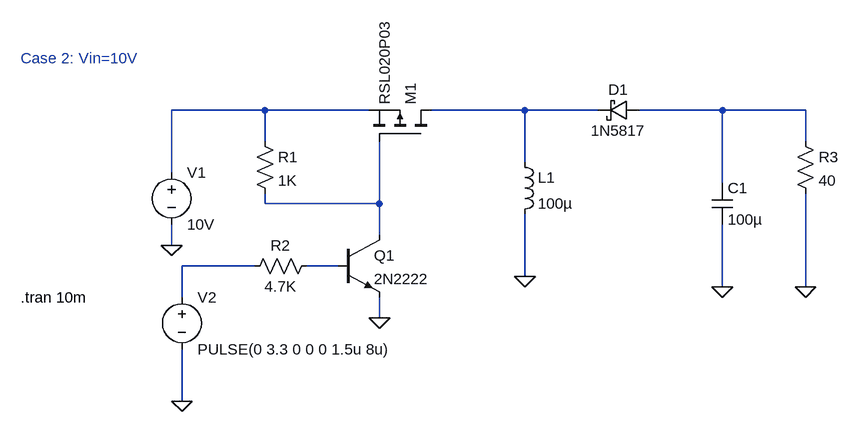
[diagram p0: schematic Buck-Boost Converter LTspice.asc]
Buck-Boost Converter LTspice.asc, the LTspice schematic file:
Version 4.1
SHEET 1 1056 680
WIRE -16 96 -160 96
WIRE 144 96 -16 96
WIRE 384 96 240 96
WIRE 496 96 384 96
WIRE 688 96 560 96
WIRE 816 96 688 96
WIRE -16 144 -16 96
WIRE 816 144 816 96
WIRE 384 176 384 96
WIRE -160 192 -160 96
WIRE 688 208 688 96
WIRE -16 240 -16 224
WIRE 160 240 160 144
WIRE 160 240 -16 240
WIRE 160 288 160 240
WIRE -160 304 -160 272
WIRE -32 336 -144 336
WIRE 96 336 48 336
WIRE 384 352 384 256
WIRE 688 368 688 272
WIRE 816 368 816 224
WIRE -144 384 -144 336
WIRE 160 416 160 384
WIRE -144 544 -144 464
FLAG -160 304 0
FLAG -144 544 0
FLAG 160 416 0
FLAG 384 352 0
FLAG 688 368 0
FLAG 816 368 0
SYMBOL pmos 240 144 M270
SYMATTR InstName M1
SYMATTR Value RSL020P03
SYMBOL npn 96 288 R0
SYMATTR InstName Q1
SYMATTR Value 2N2222
SYMBOL voltage -160 176 R0
WINDOW 123 0 0 Left 0
WINDOW 39 0 0 Left 0
SYMATTR InstName V1
SYMATTR Value 10V
SYMBOL res -32 128 R0
SYMATTR InstName R1
SYMATTR Value 1K
SYMBOL voltage -144 368 R0
WINDOW 123 0 0 Left 0
WINDOW 39 0 0 Left 0
SYMATTR InstName V2
SYMATTR Value PULSE(0 3.3 0 0 0 1.5u 8u)
SYMBOL res 64 320 R90
WINDOW 0 0 56 VBottom 2
WINDOW 3 32 56 VTop 2
SYMATTR InstName R2
SYMATTR Value 4.7K
SYMBOL ind 368 160 R0
SYMATTR InstName L1
SYMATTR Value 100µ
SYMATTR SpiceLine Rser=1m
SYMBOL schottky 560 80 R90
WINDOW 0 0 32 VBottom 2
WINDOW 3 32 32 VTop 2
SYMATTR InstName D1
SYMATTR Value 1N5817
SYMATTR Description Diode
SYMATTR Type diode
SYMBOL cap 672 208 R0
SYMATTR InstName C1
SYMATTR Value 100µ
SYMBOL res 800 128 R0
SYMATTR InstName R3
SYMATTR Value 40
TEXT -392 384 Left 2 !.tran 10m
TEXT -392 16 Left 2 ;Case 2: Vin=10V

The netlist it stands for:
* Buck-Boost Converter LTspice.asc
M1 N002 N004 N001 N001 RSL020P03
Q1 N004 N006 0 0 2N2222
V1 N001 0 10V
R1 N001 N004 1K
V2 N005 0 PULSE(0 3.3 0 0 0 1.5u 8u)
R2 N006 N005 4.7K
L1 N002 0 100µ Rser=1m
D1 N003 N002 1N5817
C1 N003 0 100µ
R3 N003 0 40
.model D D
.lib standard.dio
.model NPN NPN
.model PNP PNP
.lib standard.bjt
.model NMOS NMOS
.model PMOS PMOS
.lib standard.mos
.tran 10m
* Case 2: Vin=10V
.backanno
.end